# EAGLE design CajitaAbierta_stick (EAGLE 9.6.2)
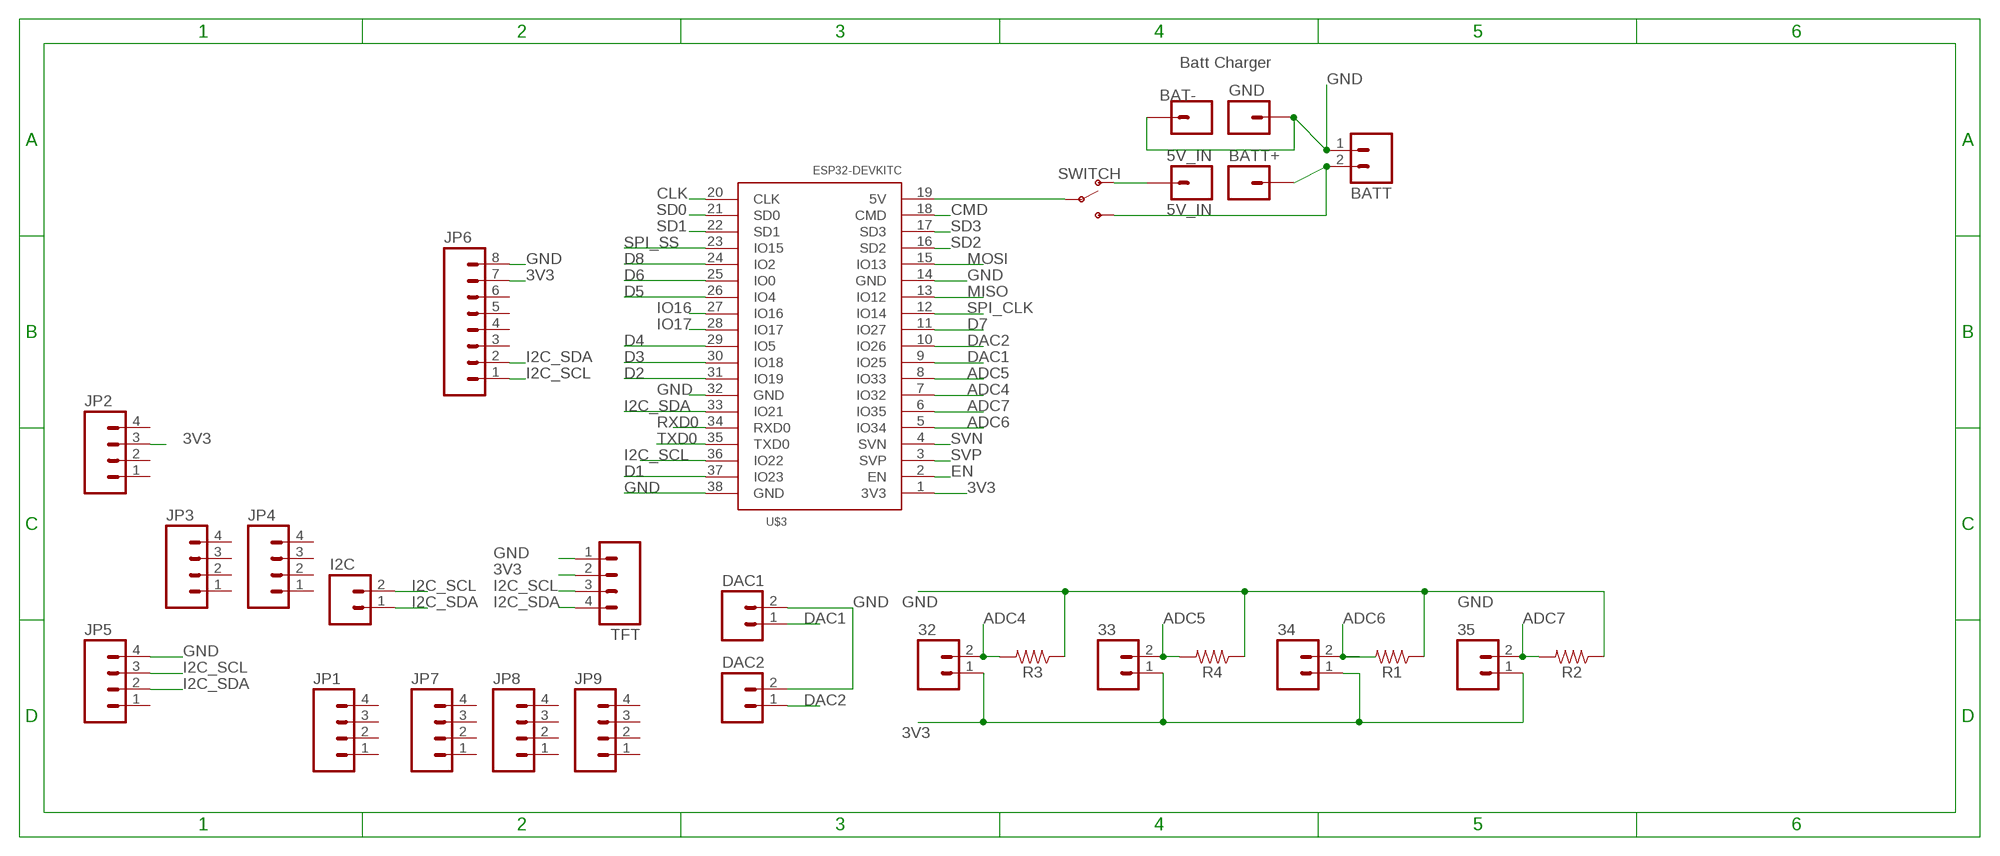
[diagram p0: schematic, sheet 1]

## Parts
5V_IN  5V_IN  M01PTH  [1X01]
32  M02PTH  [1X02]
33  M02PTH  [1X02]
34  M02PTH  [1X02]
35  M02PTH  [1X02]
BAT-  M01PTH  [1X01]
BATT  M02LOCK_LONGPADS  [1X02_LOCK_LONGPADS]
BATT+  M01PTH  [1X01]
DAC1  M02PTH  [1X02]
DAC2  M02PTH  [1X02]
GND  Batt Charger  M01PTH  [1X01]
I2C  M02PTH  [1X02]
JP1  M04NO_SILK_ALL_ROUND  [1X04_NO_SILK_ALL_ROUND]
JP2  M04NO_SILK_ALL_ROUND  [1X04_NO_SILK_ALL_ROUND]
JP3  M04NO_SILK_ALL_ROUND  [1X04_NO_SILK_ALL_ROUND]
JP4  M04NO_SILK_ALL_ROUND  [1X04_NO_SILK_ALL_ROUND]
JP5  M04NO_SILK_ALL_ROUND  [1X04_NO_SILK_ALL_ROUND]
JP6  M08  [1X08_ROUND]
JP7  M04NO_SILK_ALL_ROUND  [1X04_NO_SILK_ALL_ROUND]
JP8  M04NO_SILK_ALL_ROUND  [1X04_NO_SILK_ALL_ROUND]
JP9  M04NO_SILK_ALL_ROUND  [1X04_NO_SILK_ALL_ROUND]
R1  RESISTOR1206  [1206]
R2  RESISTOR1206  [1206]
R3  RESISTOR1206  [1206]
R4  RESISTOR1206  [1206]
SWITCH  SWITCH-SPDT-SMD-RIGHT-ANGLE  [SWITCH_SPST_SMD_A]
TFT  M04PTH  [1X04]
U$3  ESP32DEVKITC  [ESP32-DEVKITC]

## Nets
3V3: 32.1 33.1 34.1 35.1 JP2.3 JP6.7 TFT.2 U$3.1(3V3)
5V: SWITCH.2(P) U$3.19(5V)
5V_IN: 5V_IN.1 SWITCH.1(O)
ADC4: 32.2 R3.2 U$3.7(IO32)
ADC5: 33.2 R4.2 U$3.8(IO33)
ADC6: 34.2 R1.2 U$3.5(IO34)
ADC7: 35.2 R2.2 U$3.6(IO35)
BATT+: BATT+.1 BATT.2 SWITCH.3(S)
CLK: U$3.20(CLK)
CMD: U$3.18(CMD)
D1: U$3.37(IO23)
D2: U$3.31(IO19)
D3: U$3.30(IO18)
D4: U$3.29(IO5)
D5: U$3.26(IO4)
D6: U$3.25(IO0)
D7: U$3.11(IO27)
D8: U$3.24(IO2)
DAC1: DAC1.1 U$3.9(IO25)
DAC2: DAC2.1 U$3.10(IO26)
EN: U$3.2(EN)
GND: BAT-.1 BATT.1 DAC1.2 DAC2.2 GND.1 JP5.4 JP6.8 R1.1 R2.1 R3.1 R4.1 TFT.1 U$3.14(GND) U$3.32(GND) U$3.38(GND)
I2C_SCL: I2C.2 JP5.3 JP6.1 TFT.3 U$3.36(IO22)
I2C_SDA: I2C.1 JP5.2 JP6.2 TFT.4 U$3.33(IO21)
IO16: U$3.27(IO16)
IO17: U$3.28(IO17)
MISO: U$3.13(IO12)
MOSI: U$3.15(IO13)
RXD0: U$3.34(RXD0)
SD0: U$3.21(SD0)
SD1: U$3.22(SD1)
SD2: U$3.16(SD2)
SD3: U$3.17(SD3)
SPI_CLK: U$3.12(IO14)
SPI_SS: U$3.23(IO15)
SVN: U$3.4(SVN)
SVP: U$3.3(SVP)
TXD0: U$3.35(TXD0)
Unconnected: JP1.1 JP1.2 JP1.3 JP1.4 JP2.1 JP2.2 JP2.4 JP3.1 JP3.2 JP3.3 JP3.4 JP4.1 JP4.2 JP4.3 JP4.4 JP5.1 JP6.3 JP6.4 JP6.5 JP6.6 JP7.1 JP7.2 JP7.3 JP7.4 JP8.1 JP8.2 JP8.3 JP8.4 JP9.1 JP9.2 JP9.3 JP9.4

## Library data of the parts
5V_IN BAT- BATT+ GND = SparkFun-Connectors:M01: Header 1 Standard 1-pin 0.1" header. Use with straight break away headers (SKU : PRT-00116), right angle break away headers (PRT-00553), swiss pins (PRT-00743), machine pins (PRT-00117), and female headers (PRT-00115).
32-35 BATT DAC1 DAC2 I2C = SparkFun-Connectors:M02: Standard 2-pin 0.1" header. Use with - straight break away headers ( PRT-00116) - right angle break away headers (PRT-00553) - swiss pins (PRT-00743) - machine pins (PRT-00117) - female headers (PRT-00115) Molex polarized connector foot print use with: PRT-08233 with associated crimp pins and housings. 2.54_SCREWTERM for use with PRT-10571. 3.5mm Screw Terminal footprints for PRT-08084 5mm Screw Terminal footprints for use with PRT-08432
JP1-JP5 JP7-JP9 TFT = SparkFun-Connectors:M04: Header 4 Standard 4-pin 0.1" header. Use with straight break away headers (SKU : PRT-00116), right angle break away headers (PRT-00553), swiss pins (PRT-00743), machine pins (PRT-00117), and female headers (PRT-00115). Molex polarized connector foot print use with SKU : PRT-08231 with associated crimp pins and housings. 1MM SMD Version SKU: PRT-10208
JP6 = SparkFun-Connectors:M08: Header 8 Standard 8-pin 0.1" header. Use with straight break away headers (SKU : PRT-00116), right angle break away headers (PRT-00553), swiss pins (PRT-00743), machine pins (PRT-00117), and female headers (PRT-00115).
R1-R4 = SparkFun-Resistors:RESISTOR: Generic Resistor Package
SWITCH = SparkFun-Switches:SWITCH-SPDT: Single Pole, Double Throw (SPDT) Switch Single-pole, double-throw (SPDT) switch. Variant Overview SMD-AYZ0202 Surface Mount DPDT Switch <https://www.sparkfun.com/products/597> (COM-00597) Used on e.g. LilyPad Arduino USB - ATmega32U4 Board <https://www.sparkfun.com/products/12049> PTH-11.6X4.0MM SPDT Mini Power Switch <https://www.sparkfun.com/products/102> (COM-00102) Used on e.g. SparkFun Simon Says - Through-Hole Soldering Kit <https://www.sparkfun.com/products/10547> (KIT-10547) PTH-11.6X4.0MM-KIT KIT version of SPDT Mini Power Switch - Simplifies soldering by removing tStop of switch pins - only one side can be soldered. PTH-11.6X4.0MM-LOCK LOCK version of SPDT Mini Power Switch - Offset pins hold switch in place for easier soldering. SMD-RIGHT-ANGLE Surface Mount Right Angle Switch <https://www.sparkfun.com/products/10860> (COM-10860) Used on e.g. SparkFun ESP8266 Thing <https://www.sparkfun.com/products/13231>; PROD_ID: SWCH-10651; SF_SKU: COM-10860
U$3 = ESP32-DEVKITC:ESP32DEVKITC

## Board
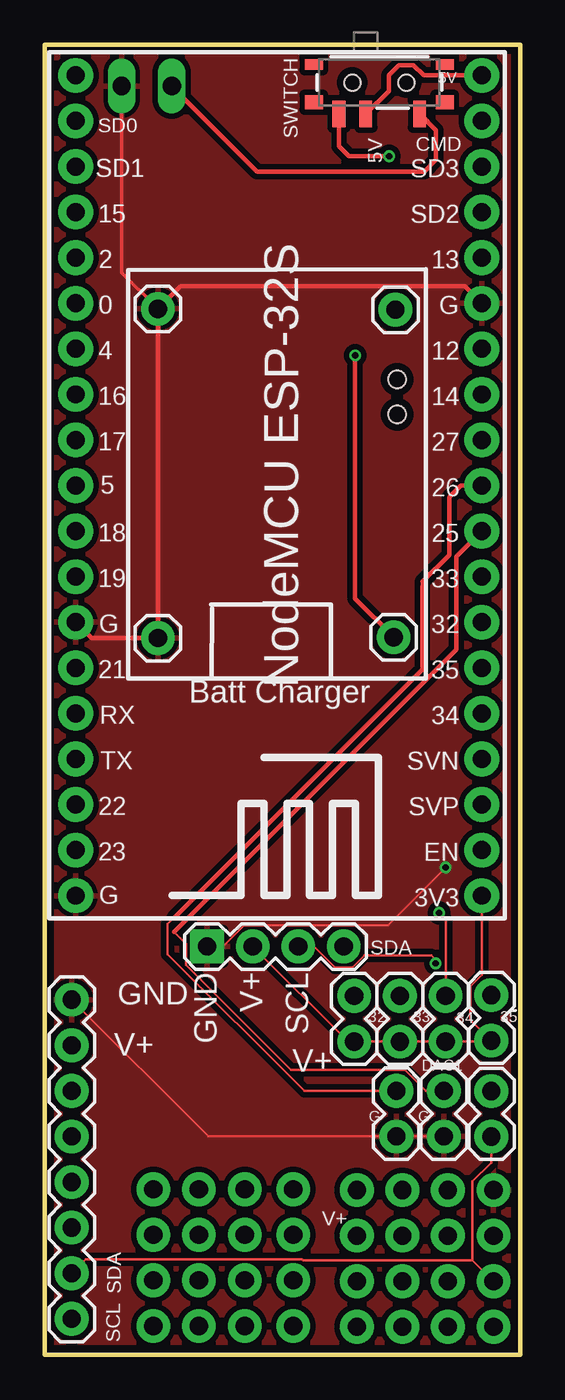
[diagram p1: board, top side]
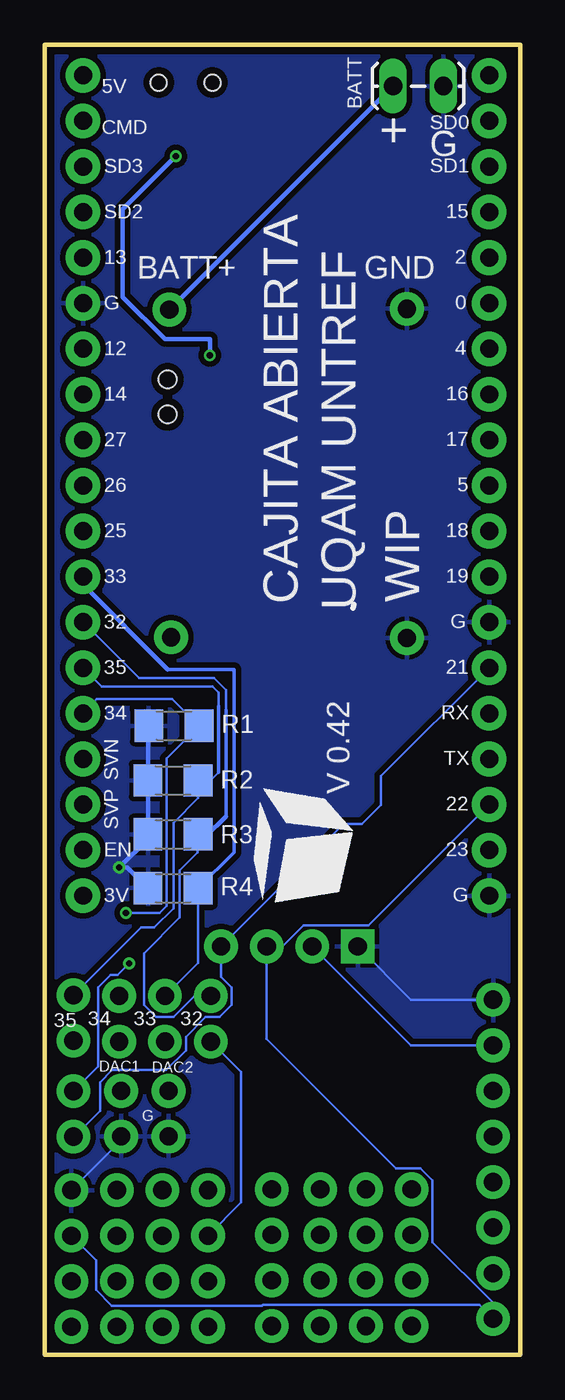
[diagram p2: board, bottom side, seen from below]

Size 26.5 x 73 mm. Coordinates in mm from the lower left corner, seen from the top.
Outline: 26.5,73 26.5,0 0,0 0,73 26.5,73
Copper layers (1*16): Top 0.035mm / dielectric 1.5mm / Bottom 0.035mm
Design rules "NOA Eagle Rule 2016-06-12": minimum track width 6mil, minimum drill 0.3mm, track to track 6mil, track to pad 6mil, pad to pad 6mil, via to via 6mil, smd to smd 0mil, copper to edge 0.4mm, drill to drill 10mil, minimum pad ring 10mil, minimum via ring 6mil, stop-mask expansion 2mil, vias tented up to drill 25mil, thermal gap 10mil
Holes 1 mm at 19.65,54.35 19.65,52.4

### Footprints (pad centres in the part's own frame; a part is rotated, then mirrored left to right if it is on the bottom)
1X01 = drill 1.016 pad 1.88: 1 0,0
1X02 = drill 1.016 pad 1.88: 1 0,0; 2 2.54,0
1X02_LOCK_LONGPADS = drill 1.016 long: 1 -0.127,0; 2 2.667,0
1X04_NO_SILK_ALL_ROUND = drill 1.016 pad 1.88: 1 0,0; 2 2.54,0; 3 5.08,0; 4 7.62,0
1X08_ROUND = drill 1.016 pad 1.88: 1 0,0; 2 2.54,0; 3 5.08,0; 4 7.62,0; 5 10.16,0; 6 12.7,0; 7 15.24,0; 8 17.78,0
1206 = smd 1.6 x 1.8: 1 -1.4,0; 2 1.4,0
SWITCH_SPST_SMD_A = smd 0.7 x 1.5: 1 -2.25,-1.75; 2 -0.75,-1.75; 3 2.25,-1.75 | smd 1 x 0.6: GND1 -3.65,1; GND3 3.65,1 | smd 1 x 0.8: GND2 -3.65,-1.1; GND4 3.65,-1.1 | hole 0.9: -1.5,0; 1.5,0
1X04 = drill 1.016 pad 1.88 square: 1 0,0 | drill 1.016 pad 1.88: 2 2.54,0; 3 5.08,0; 4 7.62,0
ESP32-DEVKITC = drill 1 pad 1.93: 1 -22.87,-11.42; 2 -20.33,-11.42; 3 -17.79,-11.42; 4 -15.25,-11.42; 5 -12.71,-11.42; 6 -10.17,-11.42; 7 -7.63,-11.42; 8 -5.09,-11.42; 9 -2.55,-11.42; 10 -0.01,-11.42; 11 2.53,-11.42; 12 5.07,-11.42; 13 7.61,-11.42; 14 10.15,-11.42; 15 12.69,-11.42; 16 15.23,-11.42; 17 17.77,-11.42; 18 20.31,-11.42; 19 22.85,-11.42; 20 22.85,11.23; 21 20.31,11.23; 22 17.77,11.23; 23 15.23,11.23; 24 12.69,11.23; 25 10.15,11.23; 26 7.61,11.23; 27 5.07,11.23; 28 2.53,11.23; 29 -0.01,11.23; 30 -2.55,11.23; 31 -5.09,11.23; 32 -7.63,11.23; 33 -10.17,11.23; 34 -12.71,11.23; 35 -15.25,11.23; 36 -17.79,11.23; 37 -20.33,11.23; 38 -22.87,11.23

### Placement (x,y rotation side)
5V_IN  19.45,39.99 0 top
32  17.25,17.45 90 top
33  19.8,17.45 90 top
34  22.35,17.45 90 top
35  24.9,17.5 90 top
BAT-  6.3,39.94 0 top
BATT  4.41,70.71 180 bottom
BATT+  19.55,58.24 0 top
DAC1  22.25,14.7 270 top
DAC2  19.6,14.7 270 top
GND  6.3,58.29 0 top
I2C  24.9,12.15 90 top
JP1  6.05,1.6 90 top
JP2  17.4,1.55 90 top
JP3  19.94,1.55 90 top
JP4  22.48,1.55 90 top
JP5  25.02,1.55 90 top
JP6  1.5,2 90 top
JP7  8.59,1.6 90 top
JP8  11.15,1.6 90 top
JP9  13.85,1.6 90 top
R1  19.3,35.05 0 bottom
R2  19.35,32 0 bottom
R3  19.35,29 0 bottom
R4  19.35,26 0 bottom
SWITCH  18.65,70.9 0 top
TFT  9.05,22.75 0 top
U$3  12.95,48.45 90 top

### Tracks (layer width: path | path; a pad name or v marks a point on that pad's centre or on a via)
3V3
  Top 0.152: TFT.2 16.89,17.45 32.1 33.1 34.1 24.85,17.45 35.1 23.73,18.67 23.73,20.52 24.37,21.16 U$3.1
  Bottom 0.152: JP6.7 6.08,17.24 TFT.2 | 32.1 15.55,15.75 15.55,8.48 JP2.3
5V
  Top 0.254: U$3.19 21.13,71.3 20.55,71.88 19.75,71.88 19.17,71.31 19.17,70.42 SWITCH.2
5V_IN  (via drill 0.35)
  Top 0.254: v17.3,55.7 17.3,42.14 5V_IN.1 | v19.2,66.8 16.95,66.8 16.4,67.35 SWITCH.1
  Bottom 0.254: v19.2,66.8 22.15,63.85 22.15,58.95 19.8,56.6 17.3,56.6 v17.3,55.7
ADC4
  Bottom 0.152: R3.2 17.98,28.98 | 17.98,28.98 18.05,28.9 | 16.4,35.93 16.4,37.05 17.05,37.7 21.25,37.7 U$3.7 | 17.98,28.98 17.98,28 18.98,27 18.98,24.36 20.97,22.37 20.97,19.51 20.28,18.82 19.32,18.82 18.15,19.99 32.2
  Bottom 0.2: 16.4,30 16.4,35.93
  Bottom 0.254: 16.4,30 17.5,28.9 18.05,28.9
ADC5
  Bottom 0.152: 33.2 17.95,21.84 R4.2 | U$3.8 24.37,42.91
  Bottom 0.2: 19.65,38.19 15.95,38.19 15.95,28 R4.2
  Bottom 0.254: 24.37,42.91 19.65,38.19
ADC6  (via drill 0.35)
  Top 0.152: v21.98,24.62 22.35,24.25 34.2
  Bottom 0.152: v21.98,24.62 20.11,24.62 19.72,25 19.72,33.23 R1.2 19.4,36.55 23.6,36.55 24.39,35.76
  Bottom 0.254: U$3.5 24.39,35.76
ADC7
  Bottom 0.152: 16.8,32.45 17.25,32 R2.2 17.95,31.02 19.33,29.64 19.33,24.88 20.41,23.8 21.14,23.8 35.2 | 16.8,36.14 16.8,36.9 17.15,37.25 23.34,37.25 U$3.6
  Bottom 0.2: 16.8,32.45 16.8,36.14
BATT+
  Top 0.254: SWITCH.3 21.8,68.25 21.8,66.59 21.15,65.94 11.84,65.94 BATT.2
  Bottom 0.254: BATT.2 BATT+.1
DAC1
  Top 0.152: 7.21,23.56 7.88,22.89 7.88,21.72 13.73,15.87 20.08,15.87 21.25,14.7 DAC1.1
  Top 0.254: U$3.9 22.96,44.49 22.96,39.31 7.21,23.56
DAC2
  Top 0.152: 7.2,24.35 6.85,24 6.85,22.31 14.47,14.7 DAC2.1
  Top 0.2: 21.05,42.83 21.05,43.08
  Top 0.254: 21.05,43.08 22.55,44.58 22.55,47.8 23.19,48.44 U$3.10 | 7.2,24.35 21.05,38.2 21.05,42.83
GND  (via drill 0.35)
  Top 0.152: DAC1.2 DAC2.2 9.12,12.16 JP6.8 | TFT.1 9.94,22.75 11.11,23.92 19.12,23.92 v22.35,27.15
  Top 0.2: GND.1 4.28,60.31 BATT.1
  Top 0.254: U$3.14 23.42,59.55 7.57,59.55 GND.1 BAT-.1 2.6,39.94 U$3.32 | 22.15,27.25 22.15,27.15 v22.35,27.15
  Bottom 0.152: TFT.1 6.08,19.78 2.1,19.78 JP6.8 | JP5.4 22.25,11.94 DAC1.2
  Bottom 0.254: R4.1 21.9,27.15 v22.35,27.15 20.75,28.75 R3.1 R2.1 20.75,35 R1.1
  pour Top (isolate 0.305): 26.5,0 0,0 0,73 26.5,73
  pour Bottom (isolate 0.305): 26.5,0 0,0 0,73 26.5,73
I2C_SCL  (via drill 0.35)
  Top 0.152: TFT.3 15.02,22.75 16.19,21.58 17.15,21.58 17.82,22.25 21.55,22.25 21.79,22.01 v21.79,21.8
  Bottom 0.152: U$3.36 8.46,23.92 12.07,23.92 13.24,22.75 TFT.3 14.13,17.6 6.92,10.39 5.57,10.39 4.88,9.7 4.88,6.27 1.5,2.89 JP6.1 2.27,2.77 14.33,2.77 14.38,2.72 22.76,2.72 23.65,3.61 23.65,5.26 JP5.3 | I2C.2 23.52,16.07 23.52,20.47 22.83,21.16 22.44,21.16 v21.8,21.8 v21.79,21.8
I2C_SDA
  Top 0.152: I2C.1 24.9,10.7 23.85,9.65 23.85,5.26 | 23.85,5.26 JP5.2 | JP6.2 2.27,5.31 14.33,5.31 14.38,5.26 23.85,5.26
  Bottom 0.152: U$3.33 7.75,32.26 7.75,30.65 8.81,29.58 9.84,29.58 TFT.4 16.67,21.06 16.08,20.47 16.08,19.51 16.77,18.82 17.53,18.82 18.63,17.72 18.63,16.97 19.73,15.87 22.73,15.87 23.42,15.18 23.42,13.58 24.85,12.15 I2C.1

### Text on the board
tNames: 5V | SDA | GND | V+ | SCL | 34 | V+ | GND | V+ | DAC1 | G | G | V+ | SDA | SCL
bNames: G | + | UQAM UNTREF | GND | BATT+ | WIP | CAJITA ABIERTA | V 0.42 | 32 | 33 | 34 | 35 | DAC2 | DAC1 | G
uqam: v0.2
noms_b: V+ | 3V3 | G | D4 | D7 | D2 | A0
192bmp: /Users/uqam/Desktop/ohanda_logo.bmp
noms_t: G | DHT11 | D7 | SPKR | 3V | A0 | D2 | G | DEL | V+ | D2 | A0 | D4 | D7 | G | G | V+ | 3V3 | V+ | MQ-7 | V+ | PWR | G
225bmp: /Users/uqam/Documents/AgitPOV_WiFi/logo_texte_gagarin.bmp